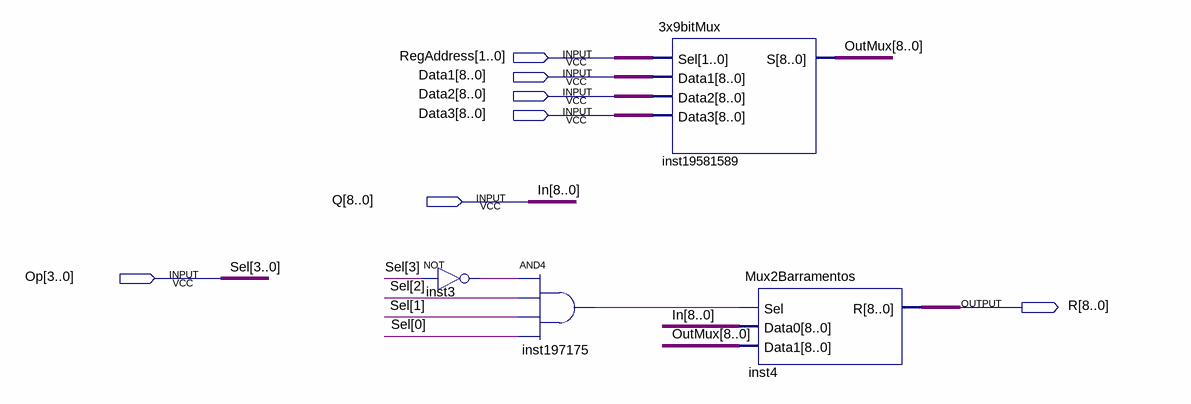
[diagram p0: schematic sheet]
// Quartus schematic MoveMux.bdf as structural Verilog: 4 symbols, 7 pins
module MoveMux (
  input  [1:0] RegAddress,
  input  [8:0] Data1,
  input  [8:0] Data2,
  input  [8:0] Data3,
  input  [8:0] Q,
  input  [3:0] Op,
  output [8:0] R
);

  wire inst3_out, inst197175_out;
  wire [8:0] OutMux;

  not inst3 (inst3_out, Op[3]);
  and inst197175 (inst197175_out, inst3_out, Op[2], Op[1], Op[0]);
  \3x9bitMux  inst19581589 (.Sel(RegAddress), .Data1(Data1), .Data2(Data2), .Data3(Data3), .S(OutMux));
  Mux2Barramentos inst4 (.Sel(inst197175_out), .Data0(Q), .Data1(OutMux), .R(R));

  // Other names for the same wires on the sheet: In[8:0] = Q; Sel[3:0] = Op
endmodule
